# Altium schematic sheet Sheet1.SchDoc
size A
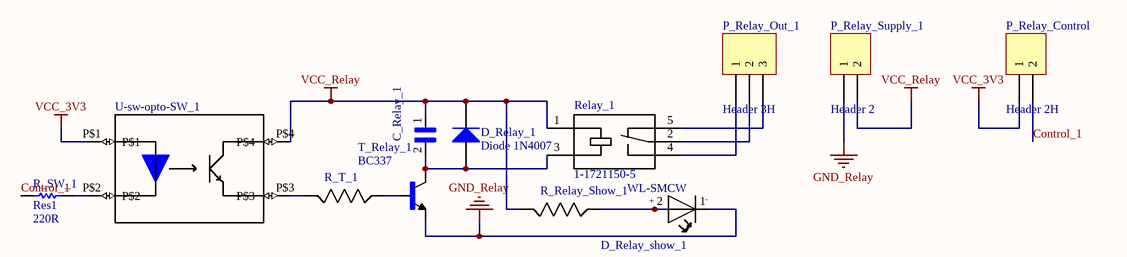
[diagram p0: Sheet1.SchDoc]

## Parts
C_Relay_1  1206YC105KA72A  [CAPC3216X94N]  (value not drawn)
D_Relay_1  Diode 1N4007  [DO-41]
D_Relay_show_1  WL-SMCW  [WL-SMCW_0603]
P_Relay_Control  Header 2H  [HDR1X2H]
P_Relay_Out_1  Header 3H  [HDR1X3H]
P_Relay_Supply_1  Header 2  [HDR1X2]
R_Relay_Show_1  CRCW12061K00FKEA  [RESC3216X65]  (value not drawn)
R_SW_1  Res1  value 220R  [AXIAL-0.3]
R_T_1  CRCW12061K00FKEA  [RESC3216X65]  (value not drawn)
Relay_1  1-1721150-5  [TE_1-1721150-5]
T_Relay_1  BC337  [TO92]
U-sw-opto-SW_1  TLP521-1  [TLP521-1_TLP521-1(Primary)]  (value not drawn)

## Nets
GND_Relay: D_Relay_show_1.1(NEG) P_Relay_Supply_1.1 T_Relay_1.1(E)
VCC_3V3: P_Relay_Control.1 U-sw-opto-SW_1.P$1
VCC_Relay: C_Relay_1.1 D_Relay_1.2(K) P_Relay_Supply_1.2 R_Relay_Show_1.1 Relay_1.1(C1) U-sw-opto-SW_1.P$4
Control_1: P_Relay_Control.2 R_SW_1.1
NetC_Relay_1_2: C_Relay_1.2 D_Relay_1.1(A) Relay_1.3(C2) T_Relay_1.3(C)
NetD_Relay_show_1_2: D_Relay_show_1.2(POS) R_Relay_Show_1.2
NetP_Relay_Out_1_1: P_Relay_Out_1.1 Relay_1.4(NO)
NetP_Relay_Out_1_2: P_Relay_Out_1.2 Relay_1.2(C)
NetP_Relay_Out_1_3: P_Relay_Out_1.3 Relay_1.5(NC)
NetR_SW_1_2: R_SW_1.2 U-sw-opto-SW_1.P$2
NetR_T_1_1: R_T_1.1 U-sw-opto-SW_1.P$3
NetR_T_1_2: R_T_1.2 T_Relay_1.2(B)

## Notes on the sheet
- (in symbol WL-SMCW) +; -

## Library data of the parts
C_Relay_1 = 1206YC105KA72A: Cap Ceramic 1uF 16V X7R 10% SMD 1206 125Â°C Embossed T/R; MF: AVX; Package: 1206 AVX; MP: 1206YC105KA72A; Price: 1.22 USD; Availability: Unavailable; SnapEDA_Link: https://www.snapeda.com/parts/1206YC105KA72A/AVX/view-part/?ref=snap; Value: *
D_Relay_1 = Diode 1N4007: 1 Amp General Purpose Rectifier; Published: 8-Jun-2000; LatestRevisionDate: 17-Jul-2002; LatestRevisionNote: Re-released for DXP Platform.; DatasheetVersion: 1998; PackageVersion: Aug-1999; PackageReference: DO-41; Publisher: Altium Limited; PackageDescription: Diode, Axial; Body 5.2 x 2.7 mm (LxDia. max), Lead Dia. 0.86 mm (max); Code_JEDEC: DO-204-AL; ComponentLink1Description: Manufacturer Link; ComponentLink1URL: http://www.fairchildsemi.com/; ComponentLink2Description: Datasheet; ComponentLink2URL: http://www.fairchildsemi.com/ds/1N%2F1N4001.pdf
D_Relay_show_1 = WL-SMCW: LED, 1206, SUP. RED, 60MCD, 630NM; Bulb Size: -; LED Colour: Red; Luminous Intensi; MF: Wurth; MP: 150120SS75000; Availability: Good; Price: 0.17 USD; Package: 1206 Würth Elektronik; SnapEDA_Link: https://www.snapeda.com/parts/150120SS75000/Wurth%20Electronics%20Inc/view-part/?ref=snap; Value: *
P_Relay_Control = Header 2H: Header, 2-Pin, Right Angle; LatestRevisionDate: 17-Jul-2002; LatestRevisionNote: Re-released for DXP Platform.; Publisher: Altium Limited
P_Relay_Out_1 = Header 3H: Header, 3-Pin, Right Angle; LatestRevisionDate: 17-Jul-2002; LatestRevisionNote: Re-released for DXP Platform.; Publisher: Altium Limited
P_Relay_Supply_1 = Header 2: Header, 2-Pin; LatestRevisionDate: 17-Jul-2002; LatestRevisionNote: Re-released for DXP Platform.; Publisher: Altium Limited
R_Relay_Show_1 = CRCW12061K00FKEA: Res Thick Film 1206 1K Ohm 1% 0.25W_1/4W_ Â±100ppm/C Molded SMD Automotive Paper T/R; MF: Vishay; Value: 18K; Package: 1206 Vishay; Availability: Good; SnapEDA_Link: https://www.snapeda.com/parts/CRCW12061K00FKEA/Vishay%20Dale/view-part/?ref=snap; Price: 0.03 USD; MP: CRCW12061K00FKEA
R_SW_1 = Res1: Resistor; Published: 8-Jun-2000; LatestRevisionDate: 17-Jul-2002; LatestRevisionNote: Re-released for DXP Platform.; PackageReference: AXIAL-0.3; Publisher: Altium Limited; PackageDescription: Axial Device, Thru-Hole; 2 Leads; 0.3 in Pin Spacing
R_T_1 = CRCW12061K00FKEA: Res Thick Film 1206 1K Ohm 1% 0.25W_1/4W_ Â±100ppm/C Molded SMD Automotive Paper T/R; MF: Vishay; Package: 1206 Vishay; Availability: Good; SnapEDA_Link: https://www.snapeda.com/parts/CRCW12061K00FKEA/Vishay%20Dale/view-part/?ref=snap; Price: 0.03 USD; MP: CRCW12061K00FKEA; Value: 1K
Relay_1 = 1-1721150-5: General Purpose Relay, ORWH Series, Power, Non Latching, SPDT, 24 VDC, 10 A; MF: TE Connectivity; MP: ORWH-SH-124D1F,000; Package: None; Price: 1.19 USD; SnapEDA_Link: https://www.snapeda.com/parts/ORWH-SH-124D1F%252C000/TE%2520Connectivity%2520Potter%2520%2526%2520Brumfield%2520Relays/view-part/?ref=snap; Availability: Good; Value: *
T_Relay_1 = BC337: NPN Bipolar Transistor; MF: ON Semiconductor; Package: TO-92 ON Semiconductor; MP: BC337; SnapEDA_Link: https://www.snapeda.com/parts/BC337/ON%2520Semiconductor/view-part/?ref=snap; Availability: Unavailable; Price: None; Value: *
U-sw-opto-SW_1 = TLP521-1: 4PIN DIP/PKG PHOTOCOUPLER GaAs IRED & PHOTO-TRANSISTOR; MF: Toshiba; SnapEDA_Link: https://www.snapeda.com/parts/TLP521-1/Toshiba/view-part/?ref=snap; Availability: Unavailable; MP: TLP521-1; Price: None; Package: None; Value: *